# Altium schematic sheet System PMU for RK3399.SchDoc: RK3399 COB Design V1.0
size A3; Author: AVIRAL MISHRA; DocumentNumber: 3; SheetNumber: 3; SheetTotal: 27; PROJECT CODE: A_V1.0
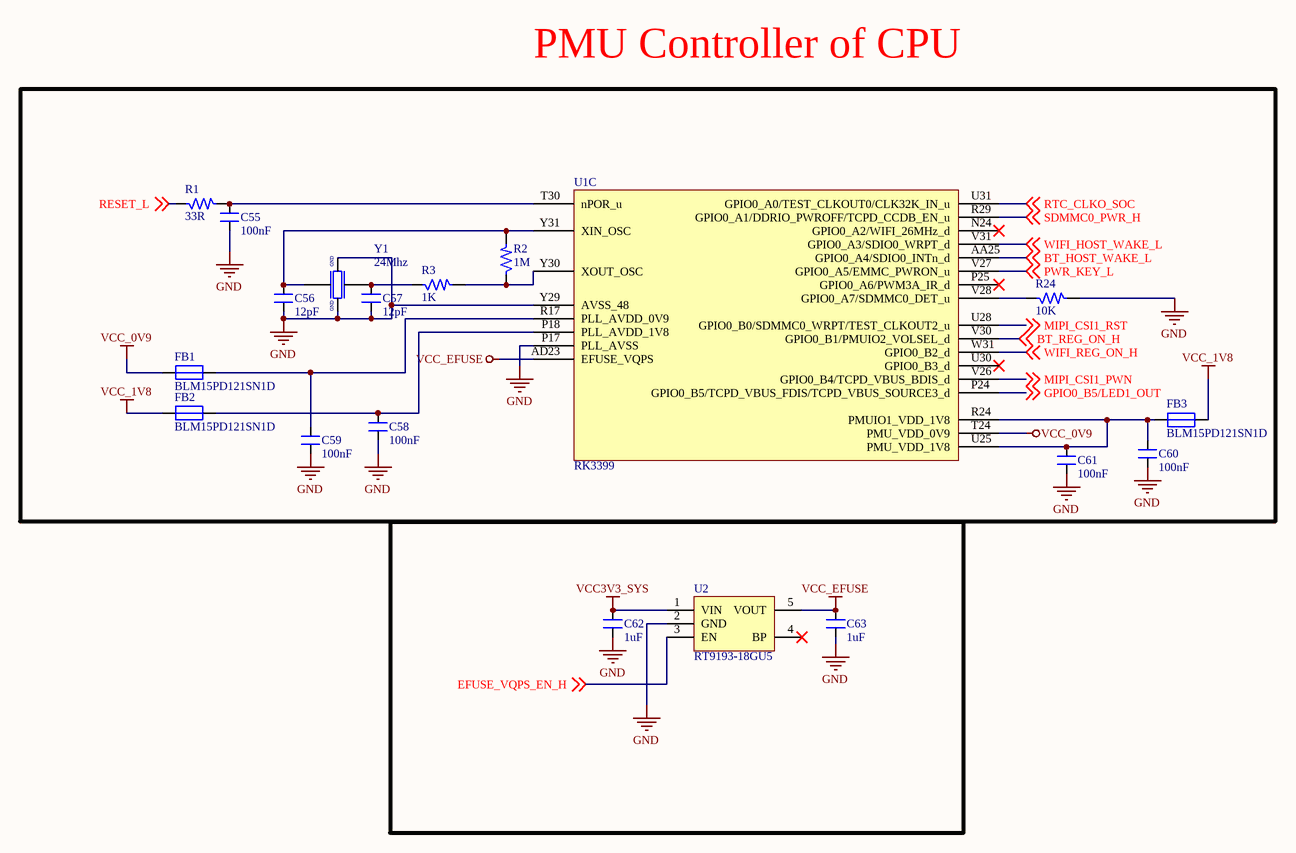
[diagram p0: System PMU for RK3399.SchDoc]

## Parts
C55  100nF  [CAP_0201]
C56  12pF  [CAP_0201]
C57  12pF  [CAP_0201]
C58  100nF  [CAP_0201]
C59  100nF  [CAP_0201]
C60  100nF  [CAP_0201]
C61  100nF  [CAP_0201]
C62  1uF  [CAP_0201]
C63  1uF  [CAP_0201]
FB1  BLM15PD121SN1D  [RES_0402]
FB2  BLM15PD121SN1D  [RES_0402]
FB3  BLM15PD121SN1D  [RES_0402]
R1  33R  [RES_0201]
R2  1M  [RES_0201]
R3  1K  [RES_0201]
R24  10K  [RES_0201]
U1  RK3399  [FBGA828_23_826X826]  (part C of 24)
U2  RT9193-18GU5  [SC70-5]
Y1  24Mhz  [XTAL_ABM8AIG-24.000MHZ-12-2Z-T3]

## Nets
GND: C55.1 C56.1 C57.1 C58.1 C59.1 C60.1 C61.1 C62.1 C63.1 R24.2 U1.P17(PLL_AVSS) U1.Y29(AVSS_48) U2.2(GND) Y1.2 Y1.4
VCC3V3_SYS: C62.2 U2.1(VIN)
VCC_0V9: FB1.1 U1.T24(PMU_VDD_0V9)
VCC_1V8: FB2.1 FB3.2
VCC_EFUSE: C63.2 U1.AD23(EFUSE_VQPS) U2.5(VOUT)
BT_HOST_WAKE_L: U1.AA25(GPIO0_A4/SDIO0_INTn_d) ; off-sheet BT_HOST_WAKE_L
BT_REG_ON_H: U1.V30(GPIO0_B1/PMUIO2_VOLSEL_d) ; off-sheet BT_REG_ON_H
EFUSE_VQPS_EN_H: U2.3(EN) ; off-sheet EFUSE_VQPS_EN_H
GPIO0_B5/LED1_OUT: U1.P24(GPIO0_B5/TCPD_VBUS_FDIS/TCPD_VBUS_SOURCE3_d) ; off-sheet GPIO0_B5/LED1_OUT
MIPI_CSI1_PWN: U1.V26(GPIO0_B4/TCPD_VBUS_BDIS_d) ; off-sheet MIPI_CSI1_PWN
MIPI_CSI1_RST: U1.U28(GPIO0_B0/SDMMC0_WRPT/TEST_CLKOUT2_u) ; off-sheet MIPI_CSI1_RST
PWR_KEY_L: U1.V27(GPIO0_A5/EMMC_PWRON_u) ; off-sheet PWR_KEY_L
RESET_L: R1.1 ; off-sheet RESET_L
RTC_CLKO_SOC: U1.U31(GPIO0_A0/TEST_CLKOUT0/CLK32K_IN_u) ; off-sheet RTC_CLKO_SOC
SDMMC0_PWR_H: U1.R29(GPIO0_A1/DDRIO_PWROFF/TCPD_CCDB_EN_u) ; off-sheet SDMMC0_PWR_H
WIFI_HOST_WAKE_L: U1.V31(GPIO0_A3/SDIO0_WRPT_d) ; off-sheet WIFI_HOST_WAKE_L
WIFI_REG_ON_H: U1.W31(GPIO0_B2_d) ; off-sheet WIFI_REG_ON_H
NetC55_2: C55.2 R1.2 U1.T30(nPOR_u)
NetC56_2: C56.2 R2.2 U1.Y31(XIN_OSC) Y1.1
NetC57_2: C57.2 R3.1 Y1.3
NetC58_2: C58.2 FB2.2 U1.P18(PLL_AVDD_1V8)
NetC59_2: C59.2 FB1.2 U1.R17(PLL_AVDD_0V9)
NetC60_2: C60.2 C61.2 FB3.1 U1.R24(PMUIO1_VDD_1V8) U1.U25(PMU_VDD_1V8)
NetR2_1: R2.1 R3.2 U1.Y30(XOUT_OSC)
NetR24_1: R24.1 U1.V28(GPIO0_A7/SDMMC0_DET_u)

Not connected (* = marked no-connect by the designer): U1 N24(GPIO0_A2/WIFI_26MHz_d)* P25(GPIO0_A6/PWM3A_IR_d)* U30(GPIO0_B3_d)*; U2 4(BP)*

## Notes on the sheet
- PMU Controller of CPU
- TITLE:
- DOCUMENT NAME:
- SCALE 1:1
- This document is copyright of EsteemPCB and shall not be revealed, produced, copied, in whole or in part, nor
- PROJECT CODE:
- TEMPLATE:
- A4
- AUTHOR:
- Sheet
- of
- used for any purpose other than submitted.
- (in symbol XTAL_24Mhz-12pF-4-SMD) GND

## Library data of the parts
C55 C58-C61 = CAP_100nF-25V-10%-0201: 0.1µF ±10% 25V Ceramic Capacitor X5R 0201 (0603 Metric) /; Manufacturer: TDK Corporation; Manufacturer Part Number: C0603X5R1E104K030BB; Case/Package: 0201; Supplier-1: Digikey
C56 C57 = CAP_12pF-16V-10%-0201: 12pF ±10% 16V Ceramic Capacitor C0G, NP0 0201 (0603 Metric) /; Manufacturer: AVX Corporation; Manufacturer Part Number: 0201YA120KAT2A; Case/Package: 0201; Supplier-1: Digikey
C62 C63 = CAP_1uF-16V-10%-0201: 1µF ±20% 16V Ceramic Capacitor X5R 0201 (0603 Metric) /; Manufacturer: Samsung Electro-Mechanics; Manufacturer Part Number: CL03A105MO3NRNH; Case/Package: 0201; Supplier-1: Digikey
FB1-FB3 = FB_120R-1.3A-100Mhz-0402: 120 Ohms @ 100MHz 1 Power Line Ferrite Bead 0402 (1005 Metric) 1.3A 90mOhm; Manufacturer: Murata Electronics; Mnaufacturer Part Number: BLM15PD121SN1D; Case/Package: 0402; Supplier-1: Digikey
R1 = RES_33R-0.05W-1%-0201: 33 Ohms ±1% 0.05W, 1/20W Chip Resistor 0201 (0603 Metric) Thick Film /; Manufacturer: Yageo; Manufacturer Part Number: RC0201FR-0733RL; Case/Package: 0201; Supplier-1: Digikey
R2 = RES_1M-0.05W-1%-0201: 1 MOhms ±1% 0.05W, 1/20W Chip Resistor 0201 (0603 Metric) Thick Film /; Manufacturer: Yageo; Manufacturer Part Number: RC0201FR-071ML; Case/Package: 0201; Supplier-1: Digikey
R3 = RES_1K-0.05W-1%-0201: 1 kOhms ±1% 0.05W, 1/20W Chip Resistor 0201 (0603 Metric) Thick Film /; Manufacturer: Yageo; Manufacturer Part Number: RC0201FR-071KL; Case/Package: 0201; Supplier-1: Digikey
R24 = RES_10K-0.05W-1%-0201: 10 kOhms ±1% 0.05W, 1/20W Chip Resistor 0201 (0603 Metric) Thick Film /; Manufacturer: Stackpole Electronics Inc; Manufacturer Part Number: RMCF0201FT10K0; Case/Package: 0201; Supplier-1: Digikey
U1 = IC_RK3399-FCBGA828: RK3399 is a low power, high performance processor for computing, personal mobile.; Manufacturer: Rockchip; Manufacturer Part Number: RK3399; Case/Package: FCBGA828; Supplier-1: Rockchip
U2 = REG_1.8V-300mA-5.5V-SC70-5: Linear Voltage Regulator IC 1 Output 300mA SC-70-5; Manufacturer: Richtek USA Inc.; Manufacturer Part Number: RT9193-18GU5; Case/Package: SC70-5; Supplier-1: Digikey
Y1 = XTAL_24Mhz-12pF-4-SMD: 24MHz ±20ppm Crystal 12pF 50 Ohms 4-SMD, No Lead /; Manufacturer: Abracon LLC; Manufacturer Part Number: ABM8AIG-24.000MHZ-12-2Z-T3; Case/Package: SMD; Supplier-1: Digikey